# Altium schematic sheet power_supply_blk.SchDoc
size A4; Date: 1/11/2016; Engineer: JBayalas; DocumentNumber: 5; Revision: V1.0; SheetNumber: 5; SheetTotal: 11
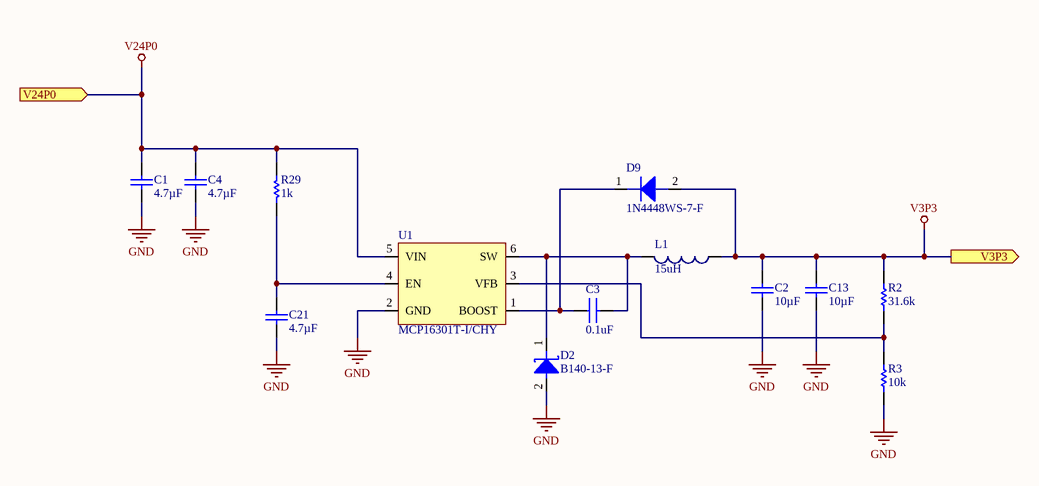
[diagram p0: power_supply_blk.SchDoc]

## Parts
C1  value 4.7µF  [C1210]  (hidden comment: *)
C2  value 10µF  [C0805]  (hidden comment: *)
C3  value 0.1uF  [C0603]  (hidden comment: *)
C4  value 4.7µF  [C1210]  (hidden comment: *)
C13  value 10µF  [C0805]  (hidden comment: *)
C21  value 4.7µF  [C1210]  (hidden comment: *)
D2  value B140-13-F  [DO-214AC, SMA]  (hidden comment: *)
D9  1N4448WS-7-F  [SOD-323]
L1  value 15uH  [MSS6132-153MLC]  (hidden comment: *)
R2  value 31.6k  [R0603]  (hidden comment: *)
R3  value 10k  [R0603]  (hidden comment: ERJ-3EKF1002V)
R29  value 1k  [R1206]  (hidden comment: *)
U1  MCP16301T-I/CHY  [SOT-23-6]

## Ports
V3P3 (out), V24P0 (in)

## Nets
GND: C1.2 C2.2 C4.2 C13.2 C21.2 D2.2(anode) R3.1 U1.2(GND)
V3P3: C2.1 C13.1 D9.2(ANODE) L1.2 R2.2 ; port V3P3
V24P0: C1.1 C4.1 R29.2 U1.5(VIN) ; port V24P0
NetC3_1: C3.1 D9.1(CATHODE) U1.1(BOOST)
NetC3_2: C3.2 D2.1(cathode) L1.1 U1.6(SW)
NetC21_1: C21.1 R29.1 U1.4(EN)
NetR2_1: R2.1 R3.2 U1.3(VFB)

## Notes on the sheet
- Title:
- Sheet:
- Date:
- of
- Project:
- Revision:
- Engineer:
- Wi4B S.r.l

## Library data of the parts
C1 C4 C21 = UMK325B7475KM-T: CAP CER 4.7UF 50V X7R 1210; MFT: Taiyo Yuden; TYPE: SMD; MPN: UMK325B7475KM-T; LOAD: *; RATING: 50V
C2 C13 = JMK212B7106KG-T: CAP CER 10UF 6.3V X7R 0805; MFT: Taiyo Yuden; TYPE: SMD; MPN: JMK212B7106KG-T; LOAD: *; RATING: 6.3V
C3 = 06033C104JAT2A: CAP CER 0.1UF 25V X7R 0603; MFT: Kyocera AVX; TYPE: SMD; MPN: 06033C104JAT2A; RATING: 25V; LOAD: *
D2 = B140-13-F: DIODE SCHOTTKY 40V 1A SMA; MFT: Diodes; TYPE: SMD; MPN: B140-13-F; RATING: 40V; LOAD: *
D9 = 1N4448WS-7-F: DIODE GEN PURP 75V 250MA SOD323; MFT: Diodes; TYPE: SMD; MPN: 1N4448WS-7-F; LOAD: *; RATING: 75V; VALUE: 1N4448WS-7-F
L1 = MSS6132-153MLC: Fixed Inductors MSS6132 AEC-Q200 15 uH 20 % 2.2 A; MFT: Coilcraft; TYPE: SMD; MPN: MSS6132-153MLC; RATING: *; LOAD: *
R2 = ERJ-3EKF3162V: RES SMD 31.6K OHM 1% 1/10W 0603; MFT: Panasonic; MPN: ERJ-3EKF3162V; TYPE: SMD; RATING: 1/10W; LOAD: *
R3 = ERJ-3EKF1002V: RES SMD 10K OHM 1% 1/10W 0603; MFT: Panasonic Electronic Components; RATING: 0.1W, 1/10W; MPN: ERJ-3EKF1002V; TYPE: Surface Mount
R29 = RNCP1206FTD1K00: RES 1K OHM 1% 1/2W 1206; MFT: Stackpole Electronics; MPN: RNCP1206FTD1K00; TYPE: SMD; RATING: 1/2W; LOAD: *
U1 = MCP16301T-I/CHY: IC REG BUCK ADJ 0.6A SOT23-6; MFT: Microchip; MPN: MCP16301T-I/CHY; RATING: 0.6A; LOAD: *; TYPE: SMD; VALUE: MCP16301T-I/CHY